# EAGLE design PCB-DISPLAYDOGM3 (EAGLE 7.7.0)

## Sheet 1 of 2
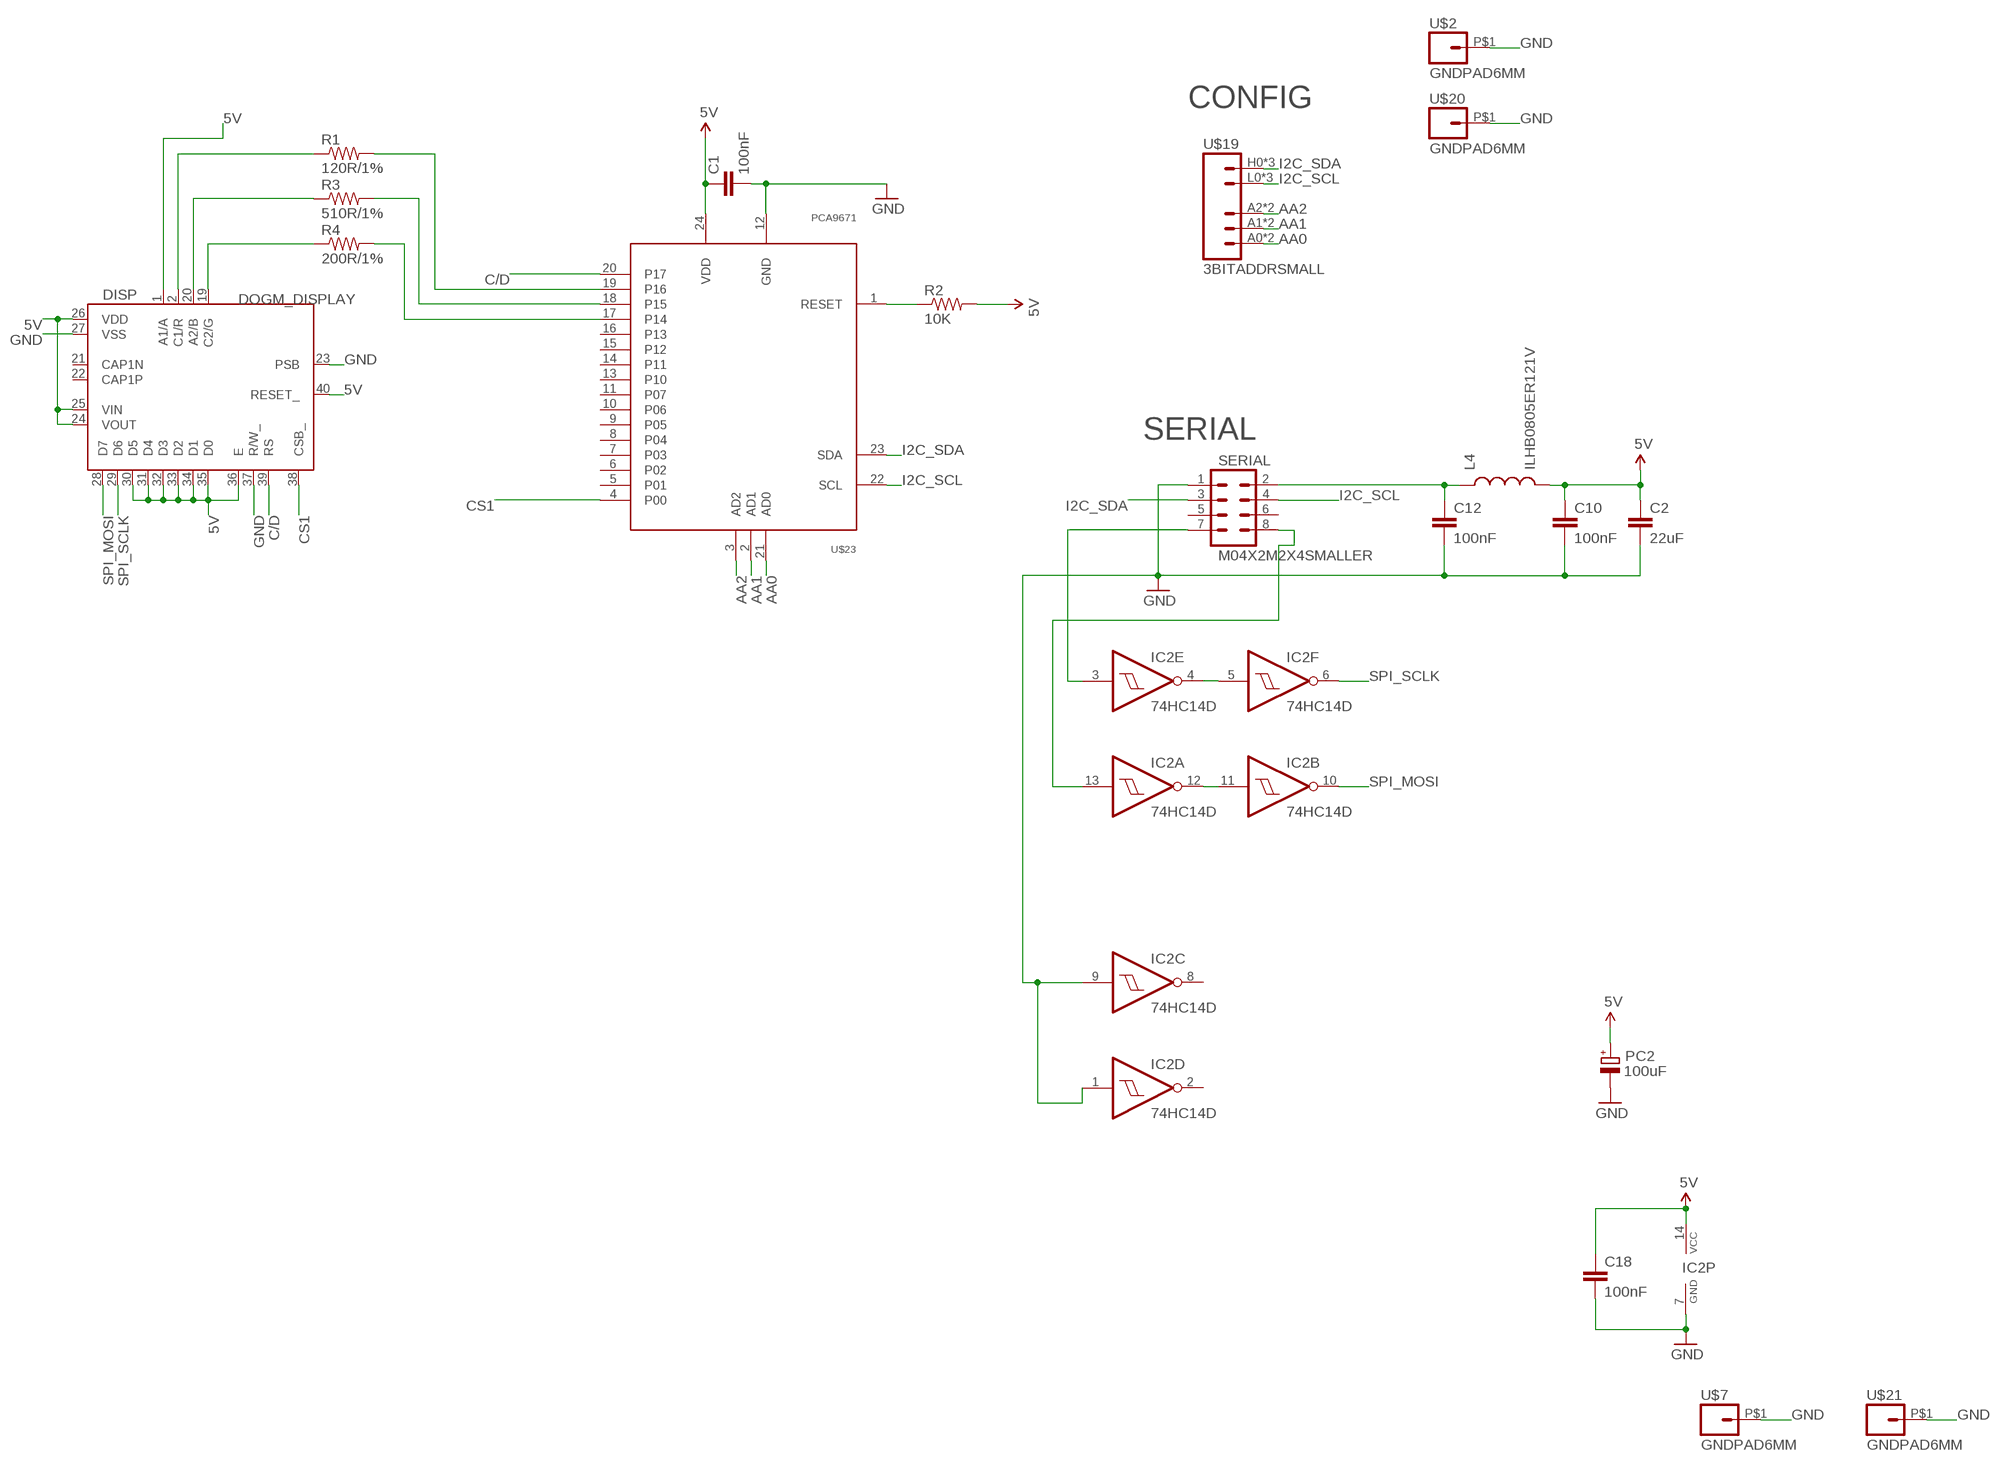
[diagram p0: schematic, sheet 1]

### Parts
C1  100nF  CAP0603-CAP  [0603-CAP]
C2  22uF  CAP0805  [0805]
C10  100nF  CAP0603-CAP  [0603-CAP]
C12  100nF  CAP0603-CAP  [0603-CAP]
C18  100nF  CAP0603-CAP  [0603-CAP]
DISP  DOGM_DISPLAY  [DOGM]
IC2  74HC14D  [SO14]
L4  ILHB0805ER121V  INDUCTOR0805  [0805]
PC2  100uF  CPOL-EUD  [PANASONIC_D]
R1  120R/1%  RESISTOR0603-RES  [0603-RES]
R2  10K  RESISTOR0603-RES  [0603-RES]
R3  510R/1%  RESISTOR0603-RES  [0603-RES]
R4  200R/1%  RESISTOR0603-RES  [0603-RES]
SERIAL  M04X2M2X4SMALLER  [M2X4SMALLER]
U$2  GNDPAD6MM  [3.2MMPAD6MM]
U$7  GNDPAD6MM  [3.2MMPAD6MM]
U$19  3BITADDRSMALL  [3BITADDR_SMALL]
U$20  GNDPAD6MM  [3.2MMPAD6MM]
U$21  GNDPAD6MM  [3.2MMPAD6MM]
U$23  PCA9671  [TSSOP24]

### Nets
5V [Power]: C1.1 C2.1 C10.1 C18.1 DISP.1(A1/A) DISP.24(VOUT) DISP.25(VIN) DISP.26(VDD) DISP.30(D5) DISP.31(D4) DISP.32(D3) DISP.33(D2) DISP.34(D1) DISP.35(D0) DISP.36(E) DISP.40(RESET_) IC2.14(P:VCC) L4.2 PC2.+ R2.2 U$23.24(VDD)
AA0: U$19.A0 U$19.AS0(A0) U$23.21(AD0)
AA1: U$19.A1 U$19.AS1(A1) U$23.2(AD1)
AA2: U$19.A2 U$19.AS2(A2) U$23.3(AD2)
ARD_5V [Power]: C12.1 L4.1 SERIAL.2
C/D: DISP.39(RS) U$23.20(P17)
CS1: DISP.38(CSB_) U$23.4(P00)
GND [Power]: C1.2 C2.2 C10.2 C12.2 C18.2 DISP.23(PSB) DISP.27(VSS) DISP.37(R/W_) IC2.1(D:I) IC2.7(P:GND) IC2.9(C:I) PC2.- SERIAL.1 U$2.P$1 U$7.P$1 U$20.P$1 U$21.P$1 U$23.12(GND)
I2C_SCL: SERIAL.4 U$19.L0(GND) U$19.L1(GND) U$19.L2(GND) U$23.22(SCL)
I2C_SDA: SERIAL.3 U$19.H0(VCC) U$19.H1(VCC) U$19.H2(VCC) U$23.23(SDA)
N$1: R2.1 U$23.1(RESET)
N$2: DISP.2(C1/R) R1.1
N$3: DISP.20(A2/B) R3.1
N$4: IC2.13(A:I) SERIAL.8
N$5: IC2.11(B:I) IC2.12(A:O)
N$6: DISP.19(C2/G) R4.1
N$7: IC2.4(E:O) IC2.5(F:I)
N$8: IC2.3(E:I) SERIAL.7
N$9: R1.2 U$23.19(P16)
N$10: R3.2 U$23.18(P15)
N$11: R4.2 U$23.17(P14)
SPI_MOSI: DISP.28(D7) IC2.10(B:O)
SPI_SCLK: DISP.29(D6) IC2.6(F:O)
Unconnected: DISP.21(CAP1N) DISP.22(CAP1P) IC2.2(D:O) IC2.8(C:O) SERIAL.5 SERIAL.6 U$23.5(P01) U$23.6(P02) U$23.7(P03) U$23.8(P04) U$23.9(P05) U$23.10(P06) U$23.11(P07) U$23.13(P10) U$23.14(P11) U$23.15(P12) U$23.16(P13)

### Notes on the sheet
- CONFIG
- SERIAL

## Sheet 2 of 2

## Library data of the parts
C1 C2 C10 C12 C18 = SparkFun:CAP: Capacitor Standard 0603 ceramic capacitor, and 0.1" leaded capacitor.
DISP = SKAARHOJ:DOGM_DISPLAY
IC2 = 74xx-eu:74*14: Hex schmitt trigger INVERTER
L4 = SparkFun:INDUCTOR: Inductors Basic Inductor/Choke - 0603 and 1206. Footprints are not proven and vary greatly between part numbers.
PC2 = rcl:CPOL-EU: POLARIZED CAPACITOR, European symbol
R1 = SparkFun:RESISTOR: Resistor Basic schematic elements and footprints for 0603, 1206, and PTH resistors.; SKAARHOJ_ID: SK_120R
R2 = SparkFun:RESISTOR: Resistor Basic schematic elements and footprints for 0603, 1206, and PTH resistors.
R3 = SparkFun:RESISTOR: Resistor Basic schematic elements and footprints for 0603, 1206, and PTH resistors.; SKAARHOJ_ID: SK_510R
R4 = SparkFun:RESISTOR: Resistor Basic schematic elements and footprints for 0603, 1206, and PTH resistors.; SKAARHOJ_ID: SK_200R
SERIAL = SKAARHOJ:M04X2
U$2 U$7 U$20 U$21 = SKAARHOJ:GNDPAD
U$19 = SKAARHOJ:3BITADDR
U$23 = SKAARHOJ:PCA9671

## Net classes
0 default: width 0.203 mm, drill 0.406 mm, clearance 0.203 mm
1 Power: width 0.406 mm, drill 0.61 mm, clearance 0.203 mm
2 BoostPower: width 0.61 mm, drill 0.61 mm, clearance 0.305 mm

## Board
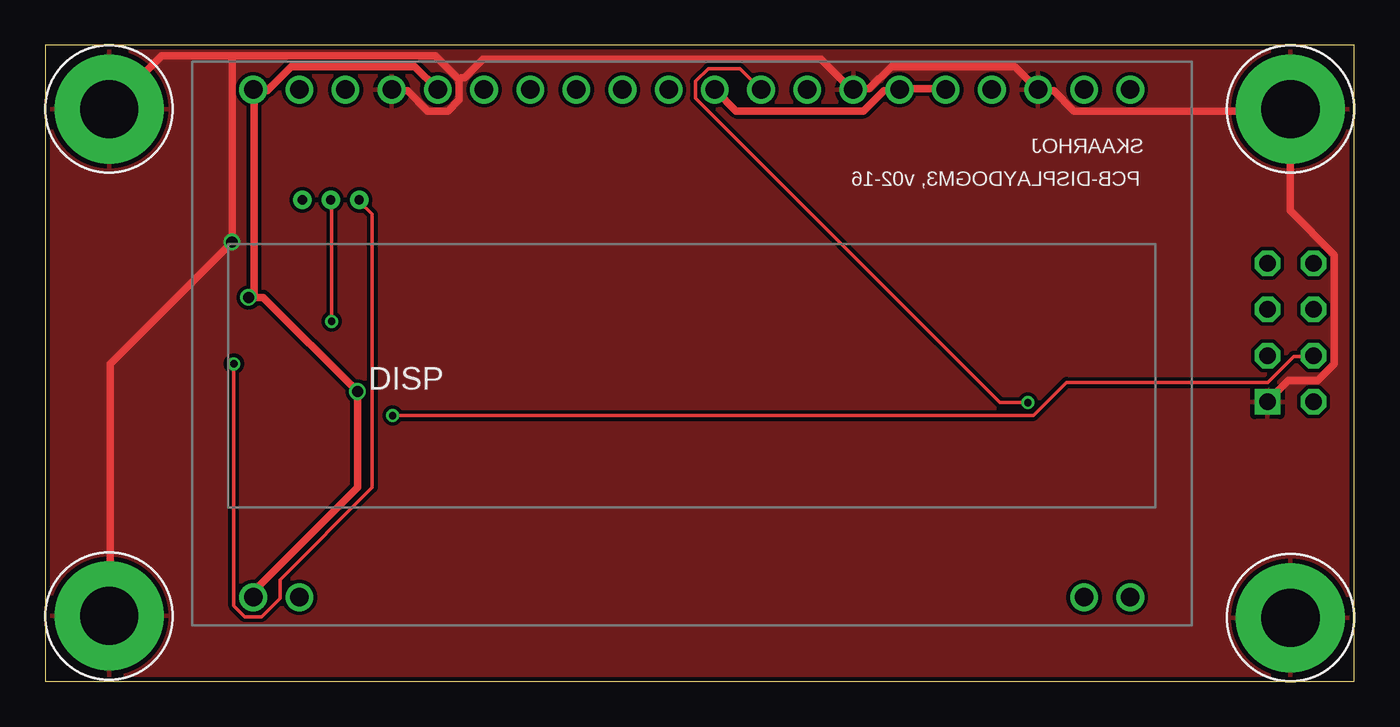
[diagram p1: board, top side]
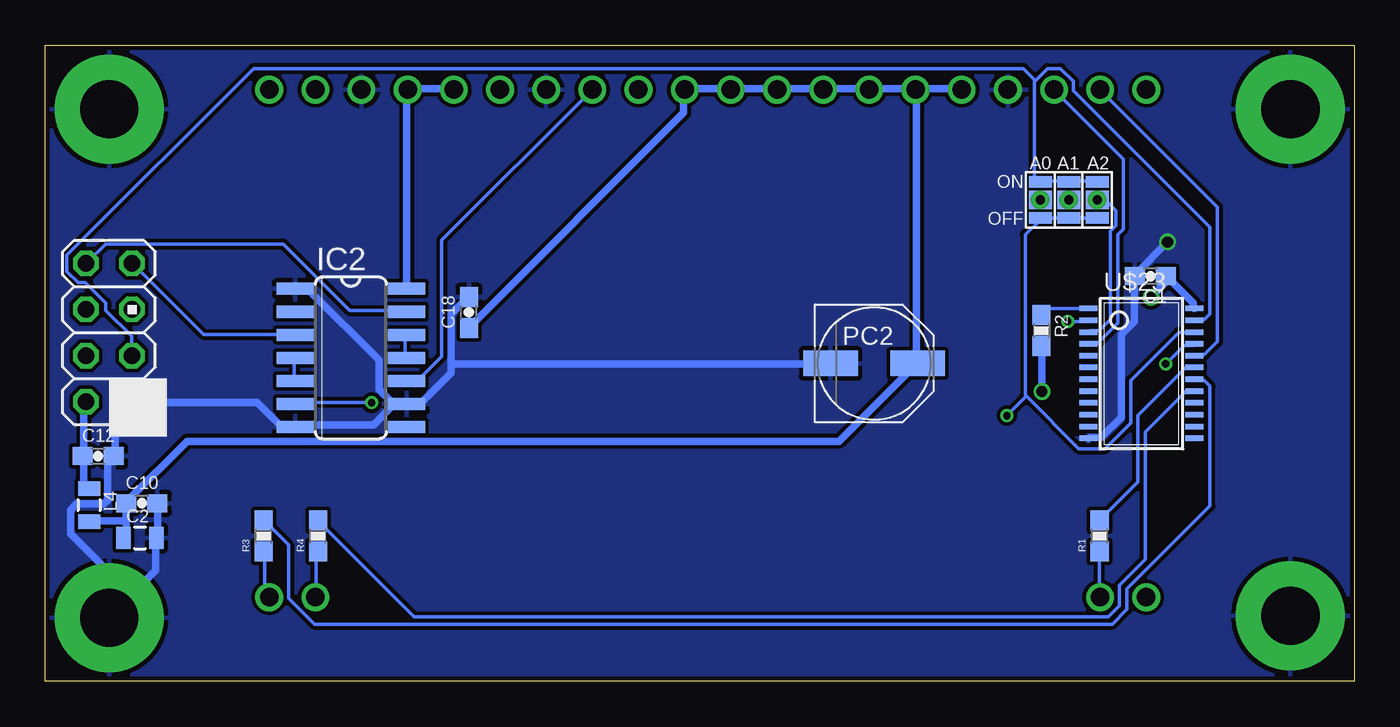
[diagram p2: board, bottom side, seen from below]

Size 72 x 35 mm. Coordinates in mm from the lower left corner, seen from the top.
Outline: 72,0 72,35 0,35 0,0 72,0
Copper layers (1*16): Top 0.035mm / dielectric 1.5mm / Bottom 0.035mm
Design rules "Fusion_eagle_rule_v1.1": minimum track width 6mil, minimum drill 12mil, track to track 6mil, track to pad 6mil, pad to pad 6mil, via to via 6mil, smd to smd 0mil, copper to edge 10mil, drill to drill 10mil, minimum pad ring 10mil, minimum via ring 6mil, stop-mask expansion 2mil, vias tented up to drill 100mil, thermal gap 10mil

### Footprints (pad centres in the part's own frame; a part is rotated, then mirrored left to right if it is on the bottom)
0603-CAP = smd 1.1 x 1: 1 -0.85,0; 2 0.85,0
0805 = smd 0.8 x 1.2: 1 -0.9,0; 2 0.9,0
DOGM = drill 1.016: 1 -24.13,-12.19; 2 -21.59,-12.19; 19 21.59,-12.19; 20 24.13,-12.19; 21 24.13,15.75; 22 21.59,15.75; 23 19.05,15.75; 24 16.51,15.75; 25 13.97,15.75; 26 11.43,15.75; 27 8.89,15.75; 28 6.35,15.75; 29 3.81,15.75; 30 1.27,15.75; 31 -1.27,15.75; 32 -3.81,15.75; 33 -6.35,15.75; 34 -8.89,15.75; 35 -11.43,15.75; 36 -13.97,15.75; 37 -16.51,15.75; 38 -19.05,15.75; 39 -21.59,15.75; 40 -24.13,15.75
SO14 = smd 0.66 x 2.032: 1 -3.81,-3.073; 2 -2.54,-3.073; 3 -1.27,-3.073; 4 0,-3.073; 5 1.27,-3.073; 6 2.54,-3.073; 7 3.81,-3.073; 8 3.81,3.073; 9 2.54,3.073; 10 1.27,3.073; 11 0,3.073; 12 -1.27,3.073; 13 -2.54,3.073; 14 -3.81,3.073
PANASONIC_D = smd 3 x 1.4: + 2.4,0; - -2.4,0
0603-RES = smd 1.1 x 1: 1 -0.85,0; 2 0.85,0
M2X4SMALLER = drill 0.9 square: 1 -1.27,3.81 | drill 0.9 octagon: 2 1.27,3.81; 3 -1.27,1.27; 4 1.27,1.27; 5 -1.27,-1.27; 6 1.27,-1.27; 7 -1.27,-3.81; 8 1.27,-3.81
3.2MMPAD6MM = drill 3.2 pad 6: P$1 0,0
3BITADDR_SMALL = drill 0.5: A0 -1.565,0; A1 0,0; A2 1.565,0 | smd 1.27 x 1: AS0 -1.565,0; AS1 0,0; AS2 1.565,0 | smd 1.27 x 0.635: H0 -1.565,1; H1 0,1; H2 1.565,1; L0 -1.565,-1; L1 0,-1; L2 1.565,-1
TSSOP24 = smd 0.305 x 0.991: 1 -4.225,-2.918; 2 -3.575,-2.918; 3 -2.925,-2.918; 4 -2.275,-2.918; 5 -1.625,-2.918; 6 -0.975,-2.918; 7 -0.325,-2.918; 8 0.325,-2.918; 9 0.975,-2.918; 10 1.625,-2.918; 11 2.275,-2.918; 12 2.925,-2.918; 13 2.925,2.918; 14 2.275,2.918; 15 1.625,2.918; 16 0.975,2.918; 17 0.325,2.918; 18 -0.325,2.918; 19 -0.975,2.918; 20 -1.625,2.918; 21 -2.275,2.918; 22 -2.925,2.918; 23 -3.575,2.918; 24 -4.225,2.918

### Placement (x,y rotation side)
C1  11.2,22.3 180 bottom
C2  66.8,7.9 0 bottom
C10  66.7,9.8 0 bottom
C12  69.1,12.4 0 bottom
C18  48.7,20.3 90 bottom
DISP  35.56,16.81 0 top
IC2  55.2,17.8 270 bottom
L4  69.6,9.7 270 bottom
PC2  26.4,17.5 0 bottom
R1  14,8 90 bottom
R2  17.2,19.3 270 bottom
R3  60,8 90 bottom
R4  57,8 90 bottom
SERIAL  68.5,19.2 180 bottom
U$2  3.5,31.5 0 top
U$7  68.5,3.5 0 top
U$19  15.7,26.5 0 bottom
U$20  68.5,31.5 0 top
U$21  3.5,3.6 0 top
U$23  11.7,16.3 270 bottom

### Tracks (layer width: path | path; a pad name or v marks a point on that pad's centre or on a via)
5V  (via drill 0.61)
  Top 0.406: DISP.1 11.48,4.67 11.48,4.98 17.17,10.67 v17.17,15.95 11.99,21.13 v11.18,21.13 11.48,21.23 11.48,32.51 DISP.40 11.68,32.51 12.19,32.51 13.51,33.83 20.32,33.83 21.54,32.61 DISP.36 | DISP.25 49.48,32.61 47.04,32.61 DISP.26 46.84,32.51 46.13,32.51 45.01,31.39 38,31.39 36.88,32.51 DISP.30
  Bottom 0.406: 67.56,8.84 67.56,8.03 67.67,7.92 C2.1 | 67.56,8.84 67.56,9.75 C10.1 67.46,9.96 64.21,13.21 28.35,13.21 24.08,17.48 PC2.+ 24.08,17.68 24.08,32.41 DISP.35 | 67.56,8.84 69.6,8.84 L4.2 | U$23.24 8.84,20.62 8.84,20.83 10.26,22.25 C1.1 10.26,22.05 v11.18,21.13 | v17.17,15.95 17.17,18.39 R2.2 | IC2.14 52.12,21.64 52.12,32.51 DISP.24 51.92,32.61 49.58,32.61 DISP.25 | DISP.36 21.64,32.61 24.08,32.61 DISP.35 | DISP.35 24.28,32.61 26.62,32.61 DISP.34 26.82,32.61 29.16,32.61 DISP.33 29.36,32.61 31.7,32.61 DISP.32 31.9,32.61 34.14,32.61 DISP.31 34.34,32.61 36.68,32.61 DISP.30 36.88,32.51 36.88,31.29 48.67,19.51 C18.1
AA0  (via drill 0.41)
  Top 0.203: v10.36,17.48 10.36,4.17 10.97,3.56 11.89,3.56 12.9,4.57 12.9,5.59 17.98,10.67 17.98,25.7 17.27,26.42 U$19.AS0
  Bottom 0.203: v10.36,17.48 9.35,18.49 8.84,18.49 U$23.21 | 17.27,26.52 U$19.AS0
AA1  (via drill 0.41)
  Top 0.203: v15.75,19.81 15.75,26.42 U$19.AS1
  Bottom 0.203: v15.75,19.81 14.63,19.81 U$23.2 | 15.75,26.52 U$19.AS1
AA2
  Bottom 0.203: U$23.3 14.53,19.3 14.02,19.3 13.41,19.91 13.41,24.79 13.11,25.09 13.11,25.91 13.61,26.42 14.12,26.42 U$19.AS2 14.22,26.52
ARD_5V
  Bottom 0.406: L4.1 69.7,10.67 69.9,10.87 69.9,12.39 C12.1 69.9,12.6 69.9,15.24 69.8,15.34 SERIAL.2
C/D
  Bottom 0.203: U$23.20 8.74,17.98 8.23,17.98 7.52,18.69 7.52,26.11 13.92,32.51 DISP.39
CS1
  Bottom 0.203: U$23.4 14.53,18.59 14.12,18.59 13.01,19.71 13.01,24.59 12.7,24.89 12.7,28.75 16.46,32.51 DISP.38
GND  (via drill 0.61)
  Top 0.406: 22.76,33.12 22.76,32 22.15,31.39 21.03,31.39 19.91,32.51 19.1,32.51 DISP.37 | 22.76,33.12 21.44,34.44 10.26,34.44 | 10.26,34.44 6.4,34.44 3.56,31.6 U$2.P$1 | 10.26,34.44 v10.26,24.18 3.56,17.48 3.56,3.66 U$21.P$1 | SERIAL.1 67.26,15.44 68.38,16.56 70,16.56 70.92,17.48 70.92,23.47 68.48,25.91 68.48,31.29 U$20.P$1 68.48,31.5 68.38,31.39 56.59,31.39 55.47,32.51 54.76,32.51 DISP.23 54.56,32.61 53.34,33.83 46.53,33.83 45.31,32.61 44.5,32.61 DISP.27 44.3,32.61 42.67,34.24 24.08,34.24 23.06,33.22 22.86,33.22 22.76,33.12
  Bottom 0.406: U$23.12 14.53,13.41 13.92,13.41 12.8,14.53 12.8,19.1 12.09,19.81 12.09,22.25 C1.2 11.99,22.45 v10.26,24.18 | C10.2 65.84,9.75 65.84,7.92 C2.2 65.94,7.72 65.94,6.1 68.48,3.56 U$7.P$1 67.36,4.88 70.61,8.13 70.61,9.45 70.31,9.75 68.78,9.75 68.58,9.96 68.58,12.09 68.38,12.29 C12.2 68.17,12.5 68.17,14.43 67.26,15.34 SERIAL.1 67.06,15.34 60.35,15.34 59.03,14.02 58.52,14.02 IC2.7 | 58.32,14.02 IC2.7 | 49.68,17.48 49.68,16.97 51.31,15.34 52.12,15.34 IC2.9 | 49.68,17.48 49.68,20.22 48.77,21.13 C18.2 | IC2.7 58.12,14.12 53.95,14.12 52.83,15.24 52.32,15.24 IC2.9 | IC2.1 58.22,21.54 57.51,21.54 53.65,17.68 53.65,16.05 52.93,15.34 IC2.9 | 49.68,17.48 28.85,17.48 PC2.-
  pour Top: 0,0 72,0 72,35 0,35
  pour Bottom: 0,0 72,0 72,35 0,35
I2C_SCL  (via drill 0.41)
  Top 0.203: v19.1,14.63 54.36,14.63 56.19,16.46 67.26,16.46 68.68,17.88 69.7,17.88 SERIAL.4
  Bottom 0.203: U$19.L2 14.22,25.5 15.65,25.5 U$19.L1 15.75,25.5 17.17,25.5 U$19.L0 17.27,25.4 18.09,24.59 18.09,15.75 18.03,15.7 | 18.03,15.7 15.14,12.8 13.72,12.8 12.29,14.22 12.29,16.56 9.65,19.2 8.84,19.2 U$23.22 | 18.03,15.7 v19.1,14.63
I2C_SDA
  Bottom 0.203: U$19.H2 14.22,27.53 15.65,27.53 U$19.H1 15.75,27.53 17.17,27.53 U$19.H0 17.27,27.53 17.58,27.84 17.58,33.02 17.53,33.07 | 17.53,33.07 16.87,33.73 16.15,33.73 15.44,33.02 15.44,32.51 7.92,24.99 7.92,20.22 8.23,19.91 8.74,19.91 U$23.23 | 17.53,33.07 18.19,33.73 60.55,33.73 70.81,23.47 70.81,22.55 70.21,21.95 69.8,21.95 68.68,20.83 68.68,20.42 67.26,19 67.26,17.98 SERIAL.3
N$1
  Bottom 0.203: U$23.1 16.87,20.52 17.17,20.22 R2.1
N$2
  Bottom 0.203: R1.1 14.02,7.11 14.02,4.67 DISP.2
N$3
  Bottom 0.203: R3.1 59.94,7.11 59.94,4.88 59.74,4.67 DISP.20
N$4
  Bottom 0.203: IC2.13 52.22,20.42 55.27,20.42 58.93,24.08 68.68,24.08 69.7,23.06 SERIAL.8
N$5
  Bottom 0.203: IC2.11 52.22,17.88 52.22,19 IC2.12
N$6
  Bottom 0.203: R4.1 57.1,7.11 57.1,4.67 DISP.19
N$7
  Bottom 0.203: IC2.5 58.32,16.56 58.32,17.78 IC2.4
N$8
  Bottom 0.203: IC2.3 58.32,19.1 63.3,19.1 67.16,22.96 SERIAL.7
N$9
  Bottom 0.203: U$23.19 8.84,17.27 9.25,17.27 11.89,14.63 11.89,10.97 13.92,8.94 R1.2
N$10
  Bottom 0.203: U$23.18 8.74,16.56 8.23,16.56 7.92,16.26 7.92,9.65 12.5,5.08 12.5,3.96 13.31,3.15 57.2,3.15 58.62,4.57 58.62,7.52 59.94,8.84 R3.2
N$11
  Bottom 0.203: U$23.17 8.84,15.95 9.25,15.95 11.48,13.72 11.48,6.71 12.9,5.28 12.9,4.17 13.51,3.56 51.71,3.56 R4.2
SPI_MOSI
  Bottom 0.203: IC2.10 52.12,16.56 51.51,16.56 50.19,17.88 50.19,24.28 41.96,32.51 DISP.28
SPI_SCLK  (via drill 0.41)
  Top 0.203: v54.05,15.34 52.53,15.34 35.76,32.11 35.76,33.02 36.47,33.73 38.2,33.73 39.32,32.61 DISP.29
  Bottom 0.203: v54.05,15.34 58.22,15.34 IC2.6

### Text on the board
_tsilk: SKAARHOJ | PCB-DISPLAYDOGM3, v02-16